# Altium project PCB_LC_T_PI_RLC_TEST.PrjPcb
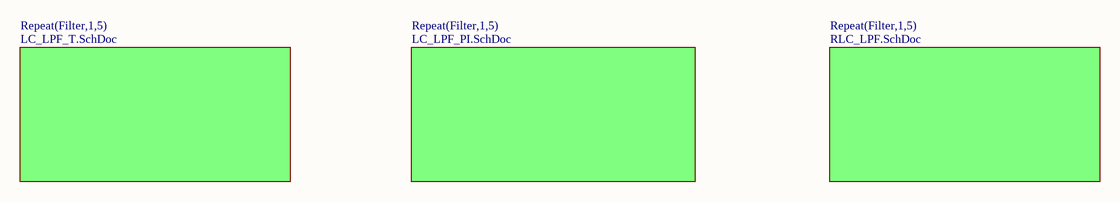
[diagram p0: Main.SchDoc]
4 sheets, 75 parts. Net scope: hierarchical (ports join the sheet entries above them; power ports are global).
Board files: PCB_LC_LPF_T_PI_PLC_TEST.PcbDoc, PCB1.PcbDoc
Sheets:
  Main.SchDoc
    Filter1 = LC_LPF_T.SchDoc
    Filter2 = LC_LPF_T.SchDoc
    Filter3 = LC_LPF_T.SchDoc
    Filter4 = LC_LPF_T.SchDoc
    Filter5 = LC_LPF_T.SchDoc
    Filter1 = LC_LPF_PI.SchDoc
    Filter2 = LC_LPF_PI.SchDoc
    Filter3 = LC_LPF_PI.SchDoc
    Filter4 = LC_LPF_PI.SchDoc
    Filter5 = LC_LPF_PI.SchDoc
    Filter1 = RLC_LPF.SchDoc
    Filter2 = RLC_LPF.SchDoc
    Filter3 = RLC_LPF.SchDoc
    Filter4 = RLC_LPF.SchDoc
    Filter5 = RLC_LPF.SchDoc

## Sheet Main.SchDoc: PCB_LC_T_PI_RLC_TEST
size A4; Author: Ravi dusi; SheetNumber: 1; SheetTotal: 4

### Sub-sheets
Repeat(Filter,1,5) = LC_LPF_T.SchDoc: no entries
Repeat(Filter,1,5) = LC_LPF_PI.SchDoc: no entries
Repeat(Filter,1,5) = RLC_LPF.SchDoc: no entries

### Notes on the sheet
- DOCUMENT NAME:
- TITLE:
- This document is created by Mitai. Any further questions can be asked through
- AUTHOR :
- REVIEWER:
- Sheet
- PART NO.:
- of
- *
- DATE:
- TEMPLATE:
- team@mitai.ai.
- A4
- Contact Address:Rosenheimer Straße 116b,81669, München.

## Sheet LC_LPF_T.SchDoc: PCB_LC_T_PI_RLC_TEST
size A4; Author: Ravi dusi; SheetNumber: 2; SheetTotal: 4
Used 5 times, as channels Filter1, Filter2, Filter3, Filter4, Filter5. Parts and nets are listed once, with the designators drawn on the sheet.
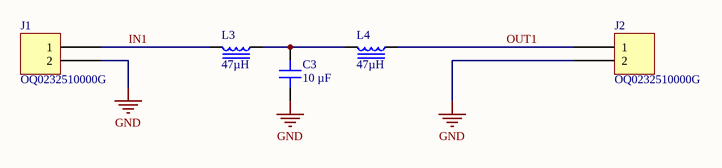
[diagram p1: LC_LPF_T.SchDoc]

### Parts
C3  10 µF  [CAP 0603_1608]
J1  OQ0232510000G  [FCI 06-381-2PIN]
J2  OQ0232510000G  [FCI 06-381-2PIN]
L3  47µH  [IND 0603_1608 RF WW]
L4  47µH  [IND 0603_1608 RF WW]

### Nets
GND: C3.1 J1.2 J2.2
IN1: J1.1 L3.2  [project net IN1_2]
OUT1: J2.1 L4.1  [project net OUT1_2]
NetC3_2: C3.2 L3.1 L4.2

### Channels
Filter1: designators end in _Filter1
Filter2: designators end in _Filter2
Filter3: designators end in _Filter3
Filter4: designators end in _Filter4
Filter5: designators end in _Filter5

### Notes on the sheet
- DOCUMENT NAME:
- TITLE:
- This document is created by Mitai. Any further questions can be asked through
- AUTHOR :
- REVIEWER:
- Sheet
- PART NO.:
- of
- *
- DATE:
- TEMPLATE:
- team@mitai.ai.
- A4
- Contact Address:Rosenheimer Straße 116b,81669, München.

### Library data of the parts
C3 = MD0603BW106M100NHT-EM: CAP CER 10UF 10V X5R 0603; manufacturer: Knowles Novacap; Tolerance: ±20%; Part Number: MD0603BW106M100NHT-EM; Value: 10 µF; Applications: Medical, Non-Critical; Capacitance: 10 µF; componentlink1description: Datasheet; componentlink1url: https://mm.digikey.com/Volume0/opasdata/d220001/medias/docus/5546/MD Series R3.pdf; componentlink2description: DigiKey Link; componentlink2url: https://www.digikey.com/en/products/detail/knowles-novacap/MD0603BW106M100NHT-EM/21406876; Device Package: 0603 (1608 Metric); lastupdated: 02/11/2023 19:09:18; Lifecycle Status: Active; Minimum Order: 1; Mounting Type: Surface Mount, MLCC; Operating Temperature: -55°C ~ 85°C; Package / Case: 0603 (1608 Metric); packaging: TapeAndReel; partid: 56748; price: 0.24; series: MD; Supplier 1: DigiKey; Supplier Part Number 1: 1763-MD0603BW106M100NHT-EMCT-ND; Temperature Coefficient: X5R; Voltage - Rated: 10V
J1 J2 = OQ0232510000G: TERM BLOCK HDR 2POS 90DEG 3.81MM; Manufacturer: Amphenol Anytek; Current - UL: 10A; Header Orientation: 90°, Right Angle; Number of Levels: 1; Number of Positions: 2; Pitch: 0.150" (3.81mm); Voltage - UL: 300V; Part Number: OQ0232510000G; Color: Green; ComponentLink1Description: Datasheet; ComponentLink1URL: http://portal.fciconnect.com/Comergent//fci/drawing/oqxx32x100j0g.pdf; ComponentLink2Description: DigiKey Link; ComponentLink2URL: //digikey.com/product-detail/en/amphenol-anytek/OQ0232510000G/609-3819-ND/2261255; Contact Mating Finish: Tin; LastUpdated: 16/12/2019 19:14:30; Lifecycle Status: 0; Minimum Order: 1; Mounting Type: Through Hole; Operating Temperature: -40°C ~ 115°C; Packaging: Bulk; Part Status: Active; Positions Per Level: 2; Price: 0.49; Series: 06-381; Supplier 1: DigiKey; Supplier Part Number 1: 609-3819-ND; Termination Style: Solder; Type: Header, Male Pins, Shrouded (4 Side)
L3 L4 = L0603B470MPWFT: INDUCTORPOWER LINE 0603 47H 20%; Manufacturer: KEMET; Current Rating (Amps): 90mA; DC Resistance (DCR): 5.8Ohm; Frequency - Self Resonant: 11MHz; Inductance Frequency - Test: 2.52MHz; Material - Core: Ferrite; Shielding: Unshielded; Type: Wirewound; Part Number: L0603B470MPWFT; ComponentLink1Description: Datasheet; ComponentLink1URL: https://api.kemet.com/component-edge/download/datasheet/L0603B470MPWFT.pdf; ComponentLink2Description: DigiKey Link; ComponentLink2URL: http://digikey.com/product-detail/en/kemet/L0603B470MPWFT/399-17776-1-ND/8601439; Device Package: 0603 (1608 Metric); Height - Seated (Max): 0.035" (0.90mm); Inductance: 47µH; LastUpdated: 06/09/2020 11:05:20; Lifecycle Status: Active; Minimum Order: 1; Mounting Type: Surface Mount; Operating Temperature: -40°C ~ 105°C; Package / Case: 0603 (1608 Metric); Packaging: TapeAndReel; PartId: 1309; Part Status: Active; Price: 0.14; Series: L-PWF; Size / Dimension: 0.063" L x 0.031" W (1.60mm x 0.80mm); Supplier 1: DigiKey; Supplier Part Number 1: 399-17776-1-ND; Supplier Device Package: 0603 (1608 Metric); Tolerance: ±20%; Value: 47µH

## Sheet LC_LPF_PI.SchDoc: PCB_RLC_LPF
size A4; Author: Ravi dusi; SheetNumber: 3; SheetTotal: 4
Used 5 times, as channels Filter1, Filter2, Filter3, Filter4, Filter5. Parts and nets are listed once, with the designators drawn on the sheet.
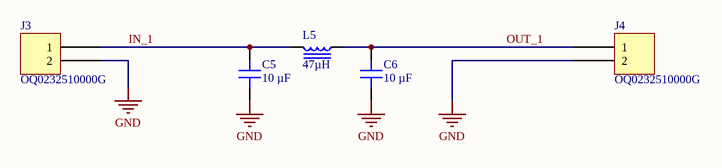
[diagram p2: LC_LPF_PI.SchDoc]

### Parts
C5  10 µF  [CAP 0603_1608]
C6  10 µF  [CAP 0603_1608]
J3  OQ0232510000G  [FCI 06-381-2PIN]
J4  OQ0232510000G  [FCI 06-381-2PIN]
L5  47µH  [IND 0603_1608 RF WW]

### Nets
GND: C5.1 C6.1 J3.2 J4.2
IN_1: C5.2 J3.1 L5.2  [project net IN_1_3]
OUT_1: C6.2 J4.1 L5.1  [project net OUT_1_3]

### Channels
Filter1: designators end in _Filter1
Filter2: designators end in _Filter2
Filter3: designators end in _Filter3
Filter4: designators end in _Filter4
Filter5: designators end in _Filter5

### Notes on the sheet
- DOCUMENT NAME:
- TITLE:
- This document is created by Mitai. Any further questions can be asked through
- AUTHOR :
- REVIEWER:
- Sheet
- PART NO.:
- of
- *
- DATE:
- TEMPLATE:
- team@mitai.ai.
- A4
- Contact Address:Rosenheimer Straße 116b,81669, München.

### Library data of the parts
C5 C6 = MD0603BW106M100NHT-EM: as C3 on sheet LC_LPF_T; Part Number: MD0603BW106M100NHT-EM; Value: 10 µF; Applications: Medical, Non-Critical; Capacitance: 10 µF; componentlink1description: Datasheet; componentlink1url: https://mm.digikey.com/Volume0/opasdata/d220001/medias/docus/5546/MD Series R3.pdf; componentlink2description: DigiKey Link; componentlink2url: https://www.digikey.com/en/products/detail/knowles-novacap/MD0603BW106M100NHT-EM/21406876; Device Package: 0603 (1608 Metric); lastupdated: 02/11/2023 19:09:18; Lifecycle Status: Active; Minimum Order: 1; Mounting Type: Surface Mount, MLCC; Operating Temperature: -55°C ~ 85°C; Package / Case: 0603 (1608 Metric); packaging: TapeAndReel; partid: 56748; price: 0.24; series: MD; Supplier 1: DigiKey; Supplier Part Number 1: 1763-MD0603BW106M100NHT-EMCT-ND; Temperature Coefficient: X5R; Voltage - Rated: 10V
J3 J4 = OQ0232510000G: as J1 on sheet LC_LPF_T; Part Number: OQ0232510000G; Color: Green; ComponentLink1Description: Datasheet; ComponentLink1URL: http://portal.fciconnect.com/Comergent//fci/drawing/oqxx32x100j0g.pdf; ComponentLink2Description: DigiKey Link; ComponentLink2URL: //digikey.com/product-detail/en/amphenol-anytek/OQ0232510000G/609-3819-ND/2261255; Contact Mating Finish: Tin; LastUpdated: 16/12/2019 19:14:30; Lifecycle Status: 0; Minimum Order: 1; Mounting Type: Through Hole; Operating Temperature: -40°C ~ 115°C; Packaging: Bulk; Part Status: Active; Positions Per Level: 2; Price: 0.49; Series: 06-381; Supplier 1: DigiKey; Supplier Part Number 1: 609-3819-ND; Termination Style: Solder; Type: Header, Male Pins, Shrouded (4 Side)
L5 = L0603B470MPWFT: as L3 on sheet LC_LPF_T; Part Number: L0603B470MPWFT; ComponentLink1Description: Datasheet; ComponentLink1URL: https://api.kemet.com/component-edge/download/datasheet/L0603B470MPWFT.pdf; ComponentLink2Description: DigiKey Link; ComponentLink2URL: http://digikey.com/product-detail/en/kemet/L0603B470MPWFT/399-17776-1-ND/8601439; Device Package: 0603 (1608 Metric); Height - Seated (Max): 0.035" (0.90mm); Inductance: 47µH; LastUpdated: 06/09/2020 11:05:20; Lifecycle Status: Active; Minimum Order: 1; Mounting Type: Surface Mount; Operating Temperature: -40°C ~ 105°C; Package / Case: 0603 (1608 Metric); Packaging: TapeAndReel; PartId: 1309; Part Status: Active; Price: 0.14; Series: L-PWF; Size / Dimension: 0.063" L x 0.031" W (1.60mm x 0.80mm); Supplier 1: DigiKey; Supplier Part Number 1: 399-17776-1-ND; Supplier Device Package: 0603 (1608 Metric); Tolerance: ±20%; Value: 47µH

## Sheet RLC_LPF.SchDoc: PCB_LC_T_PI_RLC_TEST
size A4; Author: Ravi dusi; SheetNumber: 4; SheetTotal: 4
Used 5 times, as channels Filter1, Filter2, Filter3, Filter4, Filter5. Parts and nets are listed once, with the designators drawn on the sheet.
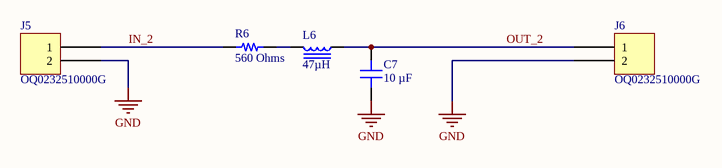
[diagram p3: RLC_LPF.SchDoc]

### Parts
C7  10 µF  [CAP 0603_1608]
J5  OQ0232510000G  [FCI 06-381-2PIN]
J6  OQ0232510000G  [FCI 06-381-2PIN]
L6  47µH  [IND 0603_1608 RF WW]
R6  560 Ohms  [RES 0603_1608]

### Nets
GND: C7.1 J5.2 J6.2
IN_2: J5.1 R6.1  [project net IN_2_4]
OUT_2: C7.2 J6.1 L6.1  [project net OUT_2_4]
NetL6_2: L6.2 R6.2

### Channels
Filter1: designators end in _Filter1
Filter2: designators end in _Filter2
Filter3: designators end in _Filter3
Filter4: designators end in _Filter4
Filter5: designators end in _Filter5

### Notes on the sheet
- DOCUMENT NAME:
- TITLE:
- This document is created by Mitai. Any further questions can be asked through
- AUTHOR :
- REVIEWER:
- Sheet
- PART NO.:
- of
- *
- DATE:
- TEMPLATE:
- team@mitai.ai.
- A4
- Contact Address:Rosenheimer Straße 116b,81669, München.

### Library data of the parts
C7 = MD0603BW106M100NHT-EM: as C3 on sheet LC_LPF_T; Part Number: MD0603BW106M100NHT-EM; Value: 10 µF; Applications: Medical, Non-Critical; Capacitance: 10 µF; componentlink1description: Datasheet; componentlink1url: https://mm.digikey.com/Volume0/opasdata/d220001/medias/docus/5546/MD Series R3.pdf; componentlink2description: DigiKey Link; componentlink2url: https://www.digikey.com/en/products/detail/knowles-novacap/MD0603BW106M100NHT-EM/21406876; Device Package: 0603 (1608 Metric); lastupdated: 02/11/2023 19:09:18; Lifecycle Status: Active; Minimum Order: 1; Mounting Type: Surface Mount, MLCC; Operating Temperature: -55°C ~ 85°C; Package / Case: 0603 (1608 Metric); packaging: TapeAndReel; partid: 56748; price: 0.24; series: MD; Supplier 1: DigiKey; Supplier Part Number 1: 1763-MD0603BW106M100NHT-EMCT-ND; Temperature Coefficient: X5R; Voltage - Rated: 10V
J5 J6 = OQ0232510000G: as J1 on sheet LC_LPF_T; Part Number: OQ0232510000G; Color: Green; ComponentLink1Description: Datasheet; ComponentLink1URL: http://portal.fciconnect.com/Comergent//fci/drawing/oqxx32x100j0g.pdf; ComponentLink2Description: DigiKey Link; ComponentLink2URL: //digikey.com/product-detail/en/amphenol-anytek/OQ0232510000G/609-3819-ND/2261255; Contact Mating Finish: Tin; LastUpdated: 16/12/2019 19:14:30; Lifecycle Status: 0; Minimum Order: 1; Mounting Type: Through Hole; Operating Temperature: -40°C ~ 115°C; Packaging: Bulk; Part Status: Active; Positions Per Level: 2; Price: 0.49; Series: 06-381; Supplier 1: DigiKey; Supplier Part Number 1: 609-3819-ND; Termination Style: Solder; Type: Header, Male Pins, Shrouded (4 Side)
L6 = L0603B470MPWFT: as L3 on sheet LC_LPF_T; Part Number: L0603B470MPWFT; ComponentLink1Description: Datasheet; ComponentLink1URL: https://api.kemet.com/component-edge/download/datasheet/L0603B470MPWFT.pdf; ComponentLink2Description: DigiKey Link; ComponentLink2URL: http://digikey.com/product-detail/en/kemet/L0603B470MPWFT/399-17776-1-ND/8601439; Device Package: 0603 (1608 Metric); Height - Seated (Max): 0.035" (0.90mm); Inductance: 47µH; LastUpdated: 06/09/2020 11:05:20; Lifecycle Status: Active; Minimum Order: 1; Mounting Type: Surface Mount; Operating Temperature: -40°C ~ 105°C; Package / Case: 0603 (1608 Metric); Packaging: TapeAndReel; PartId: 1309; Part Status: Active; Price: 0.14; Series: L-PWF; Size / Dimension: 0.063" L x 0.031" W (1.60mm x 0.80mm); Supplier 1: DigiKey; Supplier Part Number 1: 399-17776-1-ND; Supplier Device Package: 0603 (1608 Metric); Tolerance: ±20%; Value: 47µH
R6 = CRGP0603F560R: RES 560 OHM 1% 1/4W 0603; Manufacturer: TE Connectivity Passive Product; Power (Watts): 0.25W, 1/4W; Temperature Coefficient: ±100ppm/°C; Part Number: CRGP0603F560R; Value: 560 Ohms; ComponentLink1Description: Datasheet; ComponentLink1URL: https://www.te.com/commerce/DocumentDelivery/DDEController?Action=srchrtrv&DocNm=9-1773463-9&DocType=DS&DocLang=English; ComponentLink2Description: DigiKey Link; ComponentLink2URL: https://www.digikey.com/en/products/detail/te-connectivity-passive-product/CRGP0603F560R/8577015; Composition: Thick Film; Device Package: 0603 (1608 Metric); Features: Pulse Withstanding; Height - Seated (Max): 0.022" (0.55mm); LastUpdated: 02/11/2023 19:45:35; Lifecycle Status: Active; Minimum Order: 1; Number of Terminations: 2; Operating Temperature: -55°C ~ 155°C; Package / Case: 0603 (1608 Metric); Packaging: TapeAndReel; PartId: 4997; Part Status: Active; Price: 0.02; Resistance: 560 Ohms; Series: CRGP; Size / Dimension: 0.063" L x 0.031" W (1.60mm x 0.80mm); Supplier 1: DigiKey; Supplier Part Number 1: A130413CT-ND; Supplier Device Package: 0603; Tolerance: ±1%

## Nets that join several sheets
GND: Filter1 (C3_Filter1.1 J1_Filter1.2 J2_Filter1.2), Filter2 (C3_Filter2.1 J1_Filter2.2 J2_Filter2.2), Filter3 (C3_Filter3.1 J1_Filter3.2 J2_Filter3.2), Filter4 (C3_Filter4.1 J1_Filter4.2 J2_Filter4.2), Filter5 (C3_Filter5.1 J1_Filter5.2 J2_Filter5.2), Filter1 (C5_Filter1.1 C6_Filter1.1 J3_Filter1.2 J4_Filter1.2), Filter2 (C5_Filter2.1 C6_Filter2.1 J3_Filter2.2 J4_Filter2.2), Filter3 (C5_Filter3.1 C6_Filter3.1 J3_Filter3.2 J4_Filter3.2), Filter4 (C5_Filter4.1 C6_Filter4.1 J3_Filter4.2 J4_Filter4.2), Filter5 (C5_Filter5.1 C6_Filter5.1 J3_Filter5.2 J4_Filter5.2), Filter1 (C7_Filter1.1 J5_Filter1.2 J6_Filter1.2), Filter2 (C7_Filter2.1 J5_Filter2.2 J6_Filter2.2), Filter3 (C7_Filter3.1 J5_Filter3.2 J6_Filter3.2), Filter4 (C7_Filter4.1 J5_Filter4.2 J6_Filter4.2), Filter5 (C7_Filter5.1 J5_Filter5.2 J6_Filter5.2)